# Altium schematic sheet Mezclador2.SchDoc
size A4
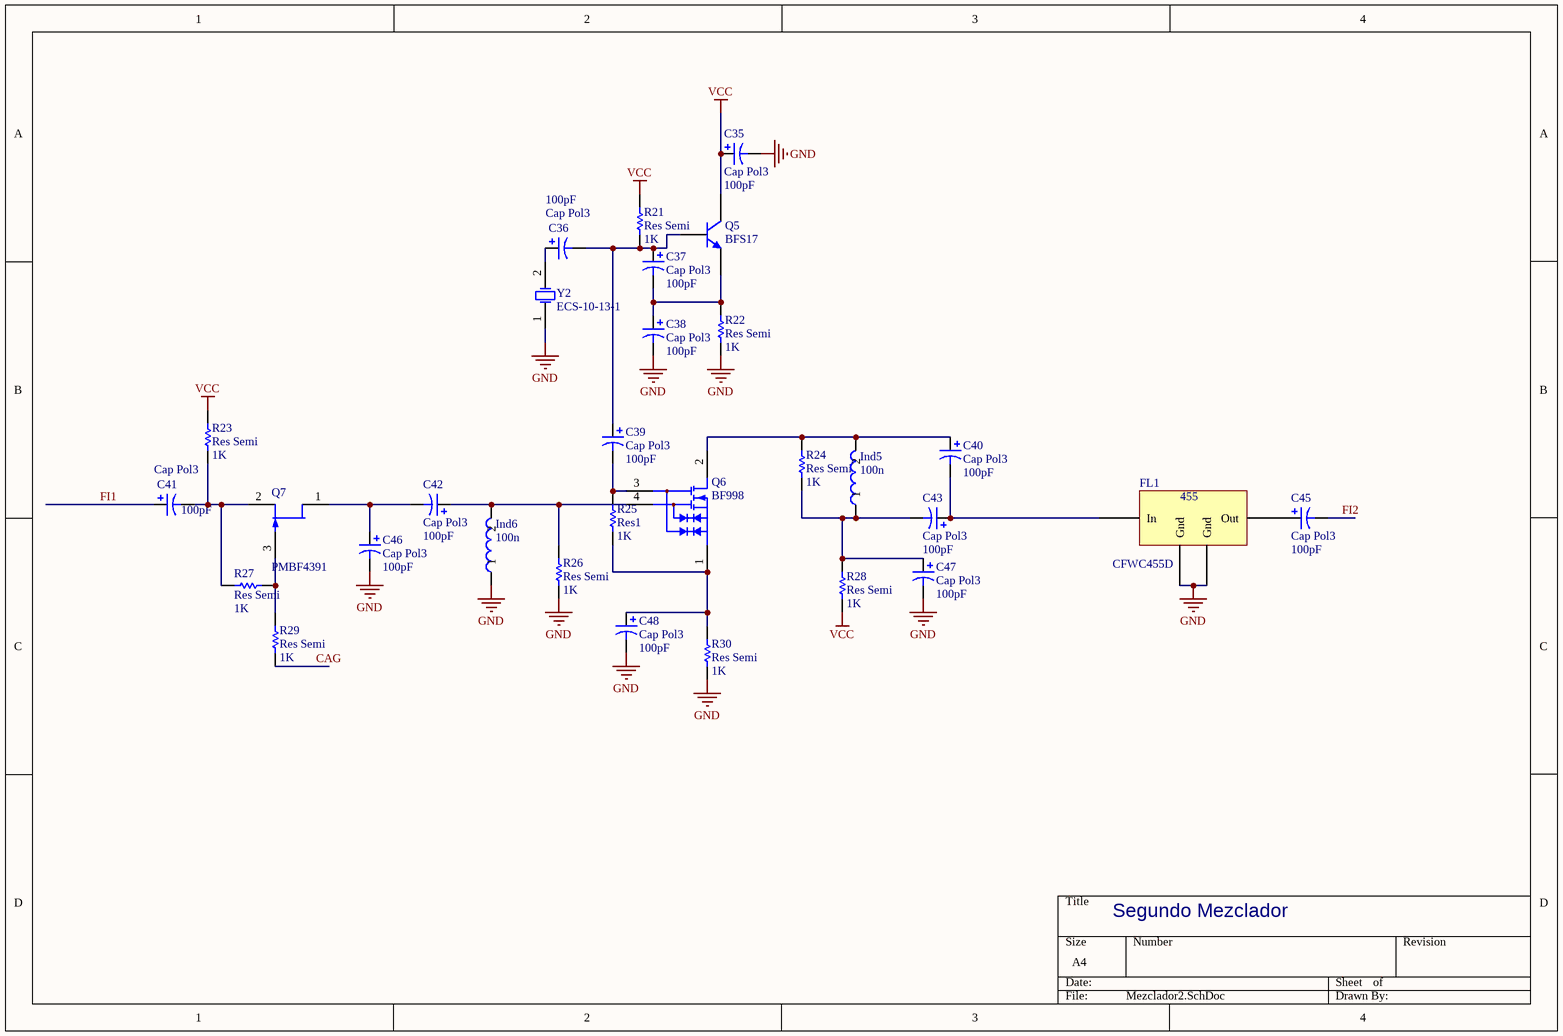
[diagram p0: Mezclador2.SchDoc]

## Parts
C35  Cap Pol3  value 100pF  [C0805]
C36  Cap Pol3  value 100pF  [C0805]
C37  Cap Pol3  value 100pF  [C0805]
C38  Cap Pol3  value 100pF  [C0805]
C39  Cap Pol3  value 100pF  [C0805]
C40  Cap Pol3  value 100pF  [C0805]
C41  Cap Pol3  value 100pF  [C0805]
C42  Cap Pol3  value 100pF  [C0805]
C43  Cap Pol3  value 100pF  [C0805]
C45  Cap Pol3  value 100pF  [C0805]
C46  Cap Pol3  value 100pF  [C0805]
C47  Cap Pol3  value 100pF  [C0805]
C48  Cap Pol3  value 100pF  [C0805]
FL1  CFWC455D  [CFWC455]
Ind5  Valor: 100n  [AXIAL-0.3]  (hidden comment: Ind2)
Ind6  Valor: 100n  [AXIAL-0.3]  (hidden comment: Ind2)
Q5  BFS17  [SOT-23]
Q6  BF998  [SOT-143]
Q7  PMBF4391  [SOT23_N]
R21  Res Semi  value 1K  [2012[0805]]
R22  Res Semi  value 1K  [2012[0805]]
R23  Res Semi  value 1K  [2012[0805]]
R24  Res Semi  value 1K  [2012[0805]]
R25  Res1  value 1K  [AXIAL-0.3]
R26  Res Semi  value 1K  [2012[0805]]
R27  Res Semi  value 1K  [2012[0805]]
R28  Res Semi  value 1K  [2012[0805]]
R29  Res Semi  value 1K  [2012[0805]]
R30  Res Semi  value 1K  [2012[0805]]
Y2  ECS-10-13-1  [HC-49U]

## Nets
GND: C35.2 C38.2 C46.2 C47.2 C48.2 FL1.3(Gnd) FL1.4(Gnd) Ind6.1 R22.1 R26.1 R30.1 Y2.1(OSC1)
VCC: C35.1 Q5.3(C) R21.2 R23.2 R28.1
CAG: R29.2
FI1: C41.1
FI2: C45.2
NetC36_1: C36.1 Y2.2(OSC2)
NetC36_2: C36.2 C37.1 C39.1 Q5.1(B) R21.1
NetC37_2: C37.2 C38.1 Q5.2(E) R22.2
NetC39_2: C39.2 Q6.3(G2) R25.2
NetC40_1: C40.1 Ind5.2 Q6.2(D) R24.2
NetC40_2: C40.2 C43.1 FL1.1(In)
NetC41_2: C41.2 Q7.2(S) R23.1 R27.1
NetC42_1: C42.1 Ind6.2 Q6.4(G1) R26.2
NetC42_2: C42.2 C46.1 Q7.1(D)
NetC43_2: C43.2 C47.1 Ind5.1 R24.1 R28.2
NetC45_1: C45.1 FL1.2(Out)
NetC48_1: C48.1 Q6.1(S) R25.1 R30.2
NetQ7_3: Q7.3(G) R27.2 R29.1

## Notes on the sheet
- Segundo Mezclador
- (in symbol CFWC455D3) 455

## Library data of the parts
C35-C43 C45-C48 = Cap Pol3: Polarized Capacitor (Surface Mount); Published: 8-Jun-2000; LatestRevisionDate: 17-Jul-2002; LatestRevisionNote: Re-released for DXP Platform.; PackageReference: C0805; Publisher: Altium Limited
FL1 = CFWC455D3: Filtro ceramico
Q5 = BFS17: NPN 1 GHz Wideband Transistor; Published: 17-Sep-2003; LatestRevisionDate: 12-Dec-2006; LatestRevisionNote: IPC-7351 Footprint Added.; DatasheetVersion: Sep-1995; PackageVersion: May-1999; PackageReference: SOT23; Publisher: Altium Limited; PackageDescription: 3-Pin SOT-23 Package 0.95 mm Pitch, 2.3 mm Lead Span; ComponentLink1Description: Manufacturer Link; ComponentLink1URL: http://www.semiconductors.philips.com/; ComponentLink2Description: Datasheet; ComponentLink2URL: http://www.semiconductors.philips.com/acrobat/datasheets/BFS17_2.pdf
Q6 = BF998: Silicon N-channel Dual-gate MOSFET; Published: 17-Sep-2003; LatestRevisionDate: 12-Dec-2006; LatestRevisionNote: IPC-7351 Footprint Added.; DatasheetVersion: Aug-1996; PackageVersion: Sep-1996; PackageReference: SOT143; Publisher: Altium Limited; PackageDescription: 4-Pin SOT-143 Package 1.9 mm Pitch, 2.3 mm Lead Span; Code_IPC: SOT143; ComponentLink1Description: Manufacturer Link; ComponentLink1URL: http://www.semiconductors.philips.com/; ComponentLink2Description: Datasheet; ComponentLink2URL: http://www.semiconductors.philips.com/acrobat/datasheets/BF998_2.pdf
Q7 = PMBF4391: N-channel Silicon Junction Field-effect Transistor; Published: 17-Sep-2003; LatestRevisionDate: 12-Dec-2006; LatestRevisionNote: IPC-7351 Footprint Added.; DatasheetVersion: Apr-1995; PackageVersion: May-1999; PackageReference: SOT23; Publisher: Altium Limited; PackageDescription: 3-Pin SOT-23 Package 0.95 mm Pitch, 2.3 mm Lead Span; ComponentLink1Description: Manufacturer Link; ComponentLink1URL: http://www.semiconductors.philips.com/; ComponentLink2Description: Datasheet; ComponentLink2URL: http://www.semiconductors.philips.com/acrobat/datasheets/PMBF4391_4392_4393_CNV_2.pdf
R21-R24 R26-R30 = Res Semi: Semiconductor Resistor; Published: 8-Jun-2000; LatestRevisionDate: 17-Jul-2002; LatestRevisionNote: Re-released for DXP Platform.; PackageReference: AXIAL-0.5; Publisher: Altium Limited
R25 = Res1: Resistor; Published: 8-Jun-2000; LatestRevisionDate: 17-Jul-2002; LatestRevisionNote: Re-released for DXP Platform.; PackageReference: AXIAL-0.3; Publisher: Altium Limited
Y2 = ECS-10-13-1: Crystal Oscillator; Published: 17-Jul-2002; DatasheetDocument: 18-Apr-2000; PackageReference: HC-49U; Publisher: Altium Limited; ComponentLink1Description: Manufacturer Link; ComponentLink1URL: http://www.ecsxtal.com/; ComponentLink2Description: Datasheet; ComponentLink2URL: http://www.ecsxtal.com/pdf2/HC49U.PDF